# Altium schematic sheet MCU + SENSORS.SchDoc
size A4; SheetNumber: 1; SheetTotal: 3
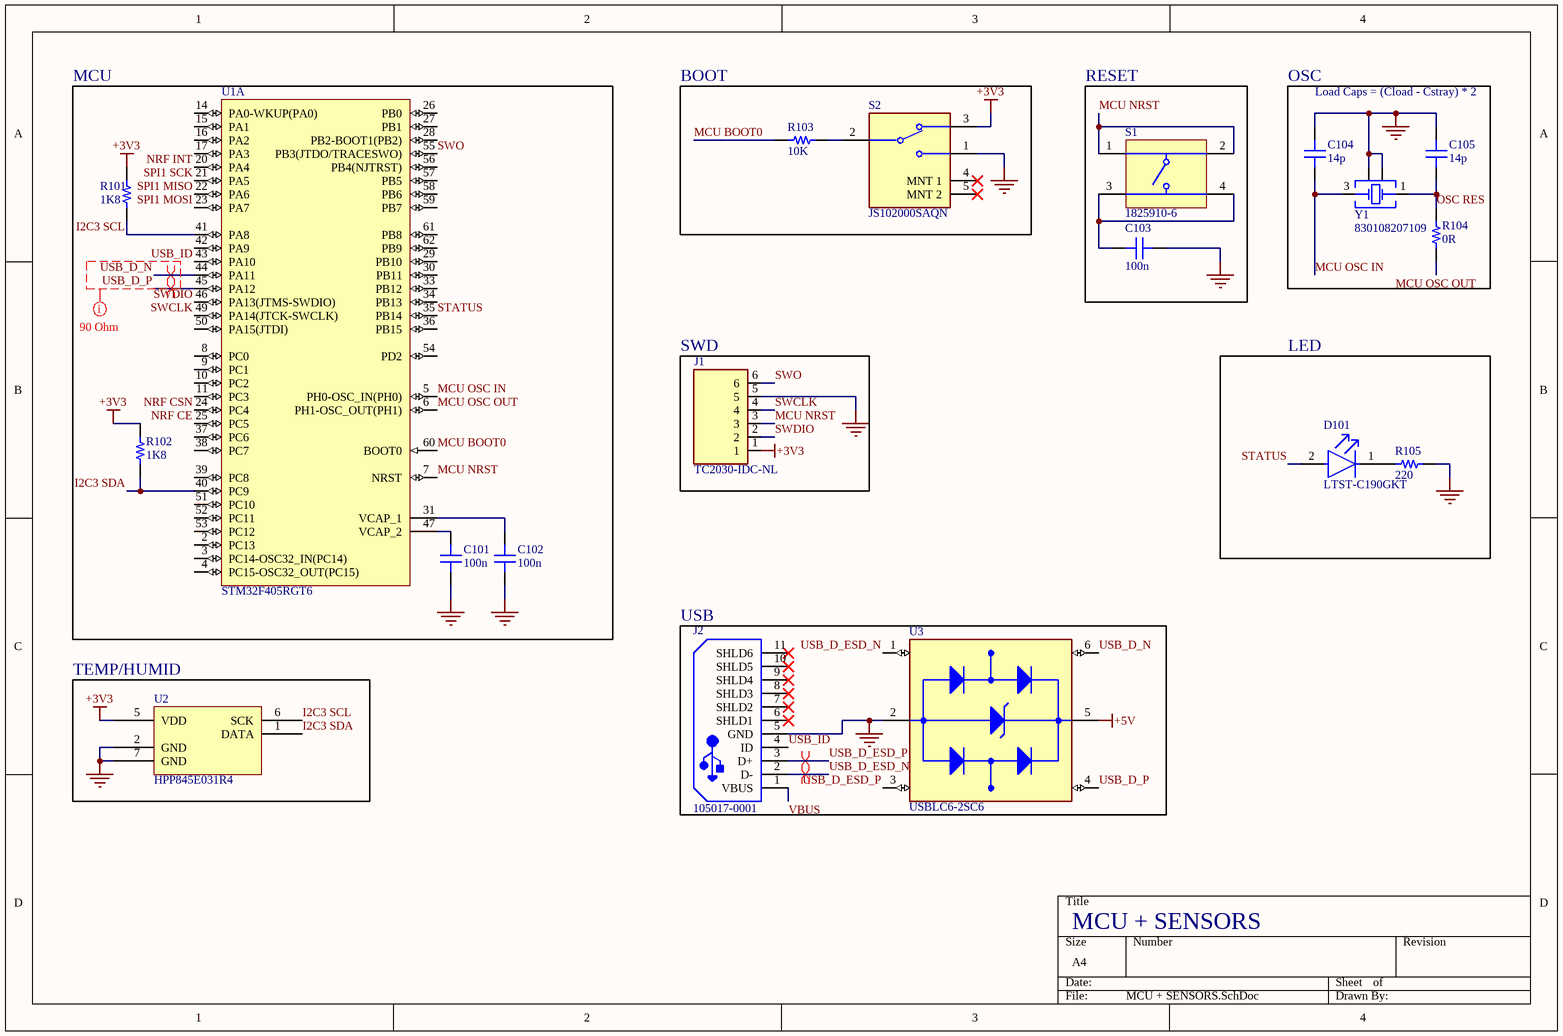
[diagram p0: MCU + SENSORS.SchDoc]

## Parts
C101  100n  [CAP 0402_1005]
C102  100n  [CAP 0402_1005]
C103  100n  [CAP 0402_1005]
C104  14p  [CAP 0402_1005]
C105  14p  [CAP 0402_1005]
D101  LTST-C190GKT  [FP-LTST-C190GKT-MFG]
J1  TC2030-IDC-NL  [TAG_TC2030-IDC-NL]
J2  105017-0001  [USB-MICRO-B_V]
R101  1K8  [RES 0402_1005]
R102  1K8  [RES 0402_1005]
R103  10K  [RES 0402_1005]
R104  0R  [RES 0402_1005]
R105  220  [RES 0402_1005]
S1  1825910-6  [TECO-1825910-6_V]
S2  JS102000SAQN  [FP-JS102000SAQN-MFG]
U1  STM32F405RGT6  [STM-LQFP64_M]  (part A of 2)
U2  HPP845E031R4  [TE HPP845E031R4]
U3  USBLC6-2SC6  [SOT95P280X145-6N]
Y1  830108207109  [WE-XTAL_CFPX-180]

## Blocks framed on the sheet
MCU: C101 C102 R101 R102 U1
BOOT: R103 S2
RESET: C103 S1
OSC: C104 C105 R104 Y1
SWD: J1
LED: D101 R105
USB: J2 U3
TEMP/HUMID: U2

## Nets
+3V3: J1.1 R101.2 R102.2 S2.3 U2.5(VDD)
+5V: U3.5(VBUS)
GND: C101.1 C102.1 C103.1 C104.2 C105.2 J1.5 J2.5(GND) R105.2 S2.1 U2.2(GND) U2.7(GND) U3.2(GND) Y1.2(GND&Lid) Y1.4(GND&Lid)
I2C3 SCL: R101.1 U1.41(PA8) U2.6(SCK)
I2C3 SDA: R102.1 U1.40(PC9) U2.1(DATA)
MCU BOOT0: R103.1 U1.60(BOOT0)
MCU NRST: J1.3 S1.1 S1.2 U1.7(NRST)
MCU OSC IN: C104.1 U1.5(PH0-OSC_IN(PH0)) Y1.3(Crystal)
MCU OSC OUT: R104.1 U1.6(PH1-OSC_OUT(PH1))
NRF CE: U1.25(PC5)
NRF CSN: U1.24(PC4)
NRF INT: U1.20(PA4)
OSC RES: C105.1 R104.2 Y1.1(Crystal)
SPI1 MISO: U1.22(PA6)
SPI1 MOSI: U1.23(PA7)
SPI1 SCK: U1.21(PA5)
STATUS: D101.2(A) U1.35(PB14)
SWCLK: J1.4 U1.49(PA14(JTCK-SWCLK))
SWDIO: J1.2 U1.46(PA13(JTMS-SWDIO))
SWO: J1.6 U1.55(PB3(JTDO/TRACESWO))
USB_D_ESD_N: J2.2(D-) U3.1(I/O1_IN)
USB_D_ESD_P: J2.3(D+) U3.3(I/O2_IN)
USB_D_N: U1.44(PA11) U3.6(I/O1_OUT)
USB_D_P: U1.45(PA12) U3.4(I/O2_OUT)
USB_ID: J2.4(ID) U1.43(PA10)
VBUS: J2.1(VBUS)
NetC101_2: C101.2 U1.47(VCAP_2)
NetC102_2: C102.2 U1.31(VCAP_1)
NetC103_2: C103.2 S1.3 S1.4
NetD101_1: D101.1(C) R105.1
NetR103_2: R103.2 S2.2(C)

Not connected (* = marked no-connect by the designer): J2 6(SHLD1)* 7(SHLD2)* 8(SHLD3)* 9(SHLD4)* 10(SHLD5)* 11(SHLD6)*; S2 4(MNT_1)* 5(MNT_2)*; U1 2(PC13) 3(PC14-OSC32_IN(PC14)) 4(PC15-OSC32_OUT(PC15)) 8(PC0) 9(PC1) 10(PC2) 11(PC3) 14(PA0-WKUP(PA0)) 15(PA1) 16(PA2) 17(PA3) 26(PB0) 27(PB1) 28(PB2-BOOT1(PB2)) 29(PB10) 30(PB11) 33(PB12) 34(PB13) 36(PB15) 37(PC6) 38(PC7) 39(PC8) 42(PA9) 50(PA15(JTDI)) 51(PC10) 52(PC11) 53(PC12) 54(PD2) 56(PB4(NJTRST)) 57(PB5) 58(PB6) 59(PB7) 61(PB8) 62(PB9)

## Layout directives
differential pair: USB_D_ESD_N, USB_D_ESD_P, USB_D_N, USB_D_P
net class 90 Ohm: USB_D_N, USB_D_P

## Notes on the sheet
- Load Caps = (Cload - Cstray) * 2
- MCU + SENSORS

## Library data of the parts
C101 C102 = CL05B104KP5VPNC: CAP CER 100NF 10V X7R 0402; manufacturer: Samsung Electro-Mechanics; Capacitance: 0.1 µF; Tolerance: ±10%; Part Number: CL05B104KP5VPNC; Value: 100n; Applications: Automotive; componentlink1description: Datasheet; componentlink1url: https://mm.digikey.com/Volume0/opasdata/d220001/medias/docus/5458/CL05B104KP5VPNC_Spec.pdf; componentlink2description: DigiKey Link; componentlink2url: https://www.digikey.com/en/products/detail/samsung-electro-mechanics/CL05B104KP5VPNC/20498482; Device Package: 0402 (1005 Metric); lastupdated: 29/01/2024 8:03:07 PM; Lifecycle Status: Active; Minimum Order: 1; Mounting Type: Surface Mount, MLCC; Operating Temperature: -55°C ~ 125°C; Package / Case: 0402 (1005 Metric); packaging: TapeAndReel; partid: 56690; price: 0.01; Ratings: AEC-Q200; series: CL; Size / Dimension: 0.039" L x 0.020" W (1.00mm x 0.50mm); Supplier 1: DigiKey; Supplier Part Number 1: 1276-CL05B104KP5VPNCCT-ND; Temperature Coefficient: X7R; Thickness (Max): 0.022" (0.55mm); Voltage - Rated: 10V
C103 = CL05B104KP5VPNC: CAP CER 100NF 10V X7R 0402; Part Number: CL05B104KP5VPNC
C104 C105 = GJM1555C1H140GB01D: CAP CER 14PF 50V C0G/NP0 0402; Part Number: GJM1555C1H140GB01D
D101 = CMP-22017-000005-2: LED GREEN CLEAR CHIP SMD; Dominant Wavelength: 569nm; Reverse Voltage: 5V; Lens Color: Colorless; Viewing Angle: 130°; Voltage: 2V; Forward Current: 30mA; Power Dissipation: 100mW; Luminous Intensity: 6mcd; Number of LEDs: 1; Forward Voltage: 2.1V; Wavelength: 565nm; Test Current: 10mA; Min Operating Temperature: -55°C; Lens Style: Clear; Mount: Surface Mount; Width: 0.8mm; Packaging: Tape and Reel; Lens Transparency: Clear; Case Code (Metric): 1608; Depth: 0.8mm; Case Code (Imperial): 0603; Case/Package: 0603; Number of Pins: 2; Max Operating Temperature: 85°C; Lead Free: Lead Free; Number of Elements: 1; Length: 1.6mm; Height: 0.8mm; Package Quantity: 1; Power Rating: 100mW; Radiation Hardening: No; Illumination Color: Green; Color: Green
J1 = TC2030-IDC-NL: CABLE ADAPTER 6 POS; Value: *; MP: TC2030-IDC-NL; Availability: Unavailable; Package: None; Price: None
J2 = CMP-2000-05827-1: Micro-USB B Receptacle, Right Angle, Bottom Mount, Surface Mount, with Solder Tabs, -30 to 85 degC, 5-Pin USB, RoHS, Tape and Reel; Manufacturer: Molex; Featured Product: Micro-USBConnectorsUSBConnectors; Other Names: WM1399DKR; Package Version: Rev. F, 12/2012; Number of Contacts: 5; Connector Type: USB-microB; Catalog Drawings: 1050170001; 3D Model: 105017-0001.stp; Mating Products: WM17145-ND-CABLEMICROUSBBTOSTDA1.0MWM17147-ND-CABLEMICROUSBBTOSTDA2.0MWM17146-ND-CABLEMICROUSBBTOSTDA1.5M; PCN Assembly/Origin: ResinSupplier21/Oct/2015; Voltage - Max: 30V; Online Catalog: Molex-MicroUSB; Manufacturer URL: http://www.molex.com/; Package Description: 5-Leads USB, Micro B, Body 7.5 x 5 mm, Pitch 0.65 mm; Datasheet URL: http://www.molex.com/elqNow/elqRedir.htm?ref=http://www.molex.com/webdocs/datasheets/pdf/en-us/1050170001_IO_CONNECTORS.pdf; Ingress Protection: -; Datasheet Version: 03/2016; Mounting Type: BoardCutout,SurfaceMount,RightAngle; Circuits: 5; Standard Package: 1; Package Reference: MICRO-B; Package URL: http://www.molex.com/pdm_docs/sd/1050170001_sd.pdf; Category: Connectors,Interconnects; Series: -; RoHS Information: 1050170001CertofCompliance; Features: Shielded,SolderRetention; Family: USB,DVI,HDMIConnectors; Specifications: -; Gender: Receptacle; Packaging: Digi-Reel®; Mounting Technology: SurfaceMount
R101-R103 R105 = RP73PF1E10KBTD: RES 10K OHM 0.1% 1/10W 0402; Part Number: RP73PF1E10KBTD
R104 = 5112: 0402 JUMPER ON TAPE AND REEL; Part Number: 5112
S1 = CMP-1684-00021-1: Tact Switch, SPST-NO, 0.05 A, -35 to 85 degC, 4-Pin THD, RoHS, Bulk; Manufacturer: TE Connectivity; Maximum Contact Resistance: 100mOhm; Mechanical Life: 100000Cycles; Bushing Type: Unthreaded; Switch Configuration: OFF(ON); Maximum DC Voltage Rating: 24V; Contact Rating @ Voltage: 0.05A@24VDC; Actuator Color: Black; Body Orientation: Straight; Function: MomentaryContact; Illumination: N/R; Actuator Style: RoundButton; Actuator Material: PolybutyleneTerephthalate; Dielectric Strength: 500VAC; Pole Throw Configuration: SPST; Actuator Length: 1.4mm; Product Weight: N/A; Contact Material: CopperAlloy; Housing Material: N/A; Terminal Type: PCPins; Minimum Insulation Resistance: 100MOhm; Package Description: 4-Pin Through Hole Device, Body 5.99 x 5.99 mm, Pitch 6.5 mm; Part No: 1825910-6; Package Reference: THD; Base Material: N/A; Manufacturer URL: http://www.te.com; Contact Plating: Silver; RoHS: Yes; Datasheet Version: Rev. C9; Electrical Life: 100000Cycles; Maximum AC Voltage Rating: N/A; Thread Size: N/R; Operating Temperature: -35to85C; Mounting: ThroughHole; Dimension: 5.99x5mm; Datasheet URL: http://www.te.com/commerce/DocumentDelivery/DDEController?Action=showdoc&DocId=Customer+Drawing%7F1825910%7FC9%7Fpdf%7FEnglish%7FENG_CD_1825910_C9.pdf%7F1825910-6; Family: 1825910; Seal Location: N/A; Seal Description: N/A; Packaging: N/A
S2 = CMP-10038-000025-1: SWITCH SLIDE SPDT 1MA 5V; Actuator Material: Nylon; Contact Resistance: 70mR; Electrical Life: 15000Cycles; Actuator Length: 1.5mm; Switch Function: On-On; Actuator Type: Standard; Actuator Color: Black; Current Rating: 1mA; Throw Configuration: SPDT; Termination: Gull Wing; Housing Material: Nylon; Max Operating Temperature: 85°C; Max Voltage Rating (DC): 5V; Voltage Rating (DC): 5V; Contact Plating: Silver; Radiation Hardening: No; Package Quantity: 1; REACH SVHC: No SVHC; RoHS Compliant: Yes; Orientation: Right Angle; Max Current Rating: 1mA; Case/Package: SMD/SMT; Contact Current Rating: 1mA; Contact Material: Copper Alloy; Mount: Surface Mount; Flammability Rating: UL94 V-2; Packaging: Tape and Reel; Switch Travel: 1.5mm; Length: 7.8mm; Series: JS; Min Operating Temperature: -20°C; Depth: 4.82mm
U1 = CMP-0243-00019-3: ARM Cortex-M4 32-bit MCU+FPU, 210 DMIPS, 1024 kB Flash, 192 kB Internal RAM, 51 I/Os, 64-pin LQFP, -40 to 85 degC, Tray; Manufacturer: STMicroelectronics; Supply Voltage(Vcc) min (V): 1.8; Supply Voltage(Vcc) max (V): 3.6; Internal RAM Size (kB): 192; I/Os (High Current): 51; D/A Converter: 2x12-bit; FLASH Size (Prog) (kB): 1024; Operating Frequency(F) (Processor speed) (MHz): 168; ComponentLink2Description: Datasheet; PackageVersion: Rev. 4, 06/2013; DatasheetVersion: Rev. 4; Core: ARM Cortex-M4; ComponentLink2URL: http://www.st.com/st-web-ui/static/active/en/resource/technical/document/datasheet/DM00037051.pdf; PackageReference: LQFP64; Packing: Tray; ComponentLink1Description: Manufacturer URL; ComponentLink3URL: http://www.st.com/st-web-ui/static/active/en/resource/technical/document/datasheet/DM00037051.pdf; ComponentLink3Description: Package Specification; Mounting Technology: Surface Mount; ComponentLink1URL: http://www.st.com/web/en/home.html; PackageDescription: 64-Pin Low Profile Quad Flat Package, 10 x 10 mm Body, 0.5 mm Pitch; PartNumber: STM32F405RGT6
U2 = HPP845E031R4: SENSOR HUMID/TEMP 3V I2C 2% SMD; Part Number: HPP845E031R4
U3 = USBLC6-2SC6: 17V Clamp 5A (8/20Âµs) Ipp Tvs Diode Surface Mount SOT-23-6; MF: STMicroelectronics; Value: *; SnapEDA_Link: https://www.snapeda.com/parts/USBLC6-2SC6/STMicroelectronics/view-part/?ref=snap; Check_prices: https://www.snapeda.com/parts/USBLC6-2SC6/STMicroelectronics/view-part/?ref=eda; Purchase-URL: https://pricing.snapeda.com/search/part/USBLC6-2SC6/?ref=eda; Price: None; Availability: In Stock; Package: SOT-23-6 STMicroelectronics; MP: USBLC6-2SC6
Y1 = CMP-03913-116855757-1: 830108207109 WE-XTAL Quartz Crystal; Frequency: 16MHz; Width: 2.5mm; Max Operating Temperature: 85°C; Height: 800µm; NexarPartId: 116855757; Min Operating Temperature: -40°C; Length: 3.2mm